# Altium schematic sheet switches_connectors.SchDoc
size A4; SheetNumber: 2; SheetTotal: 6
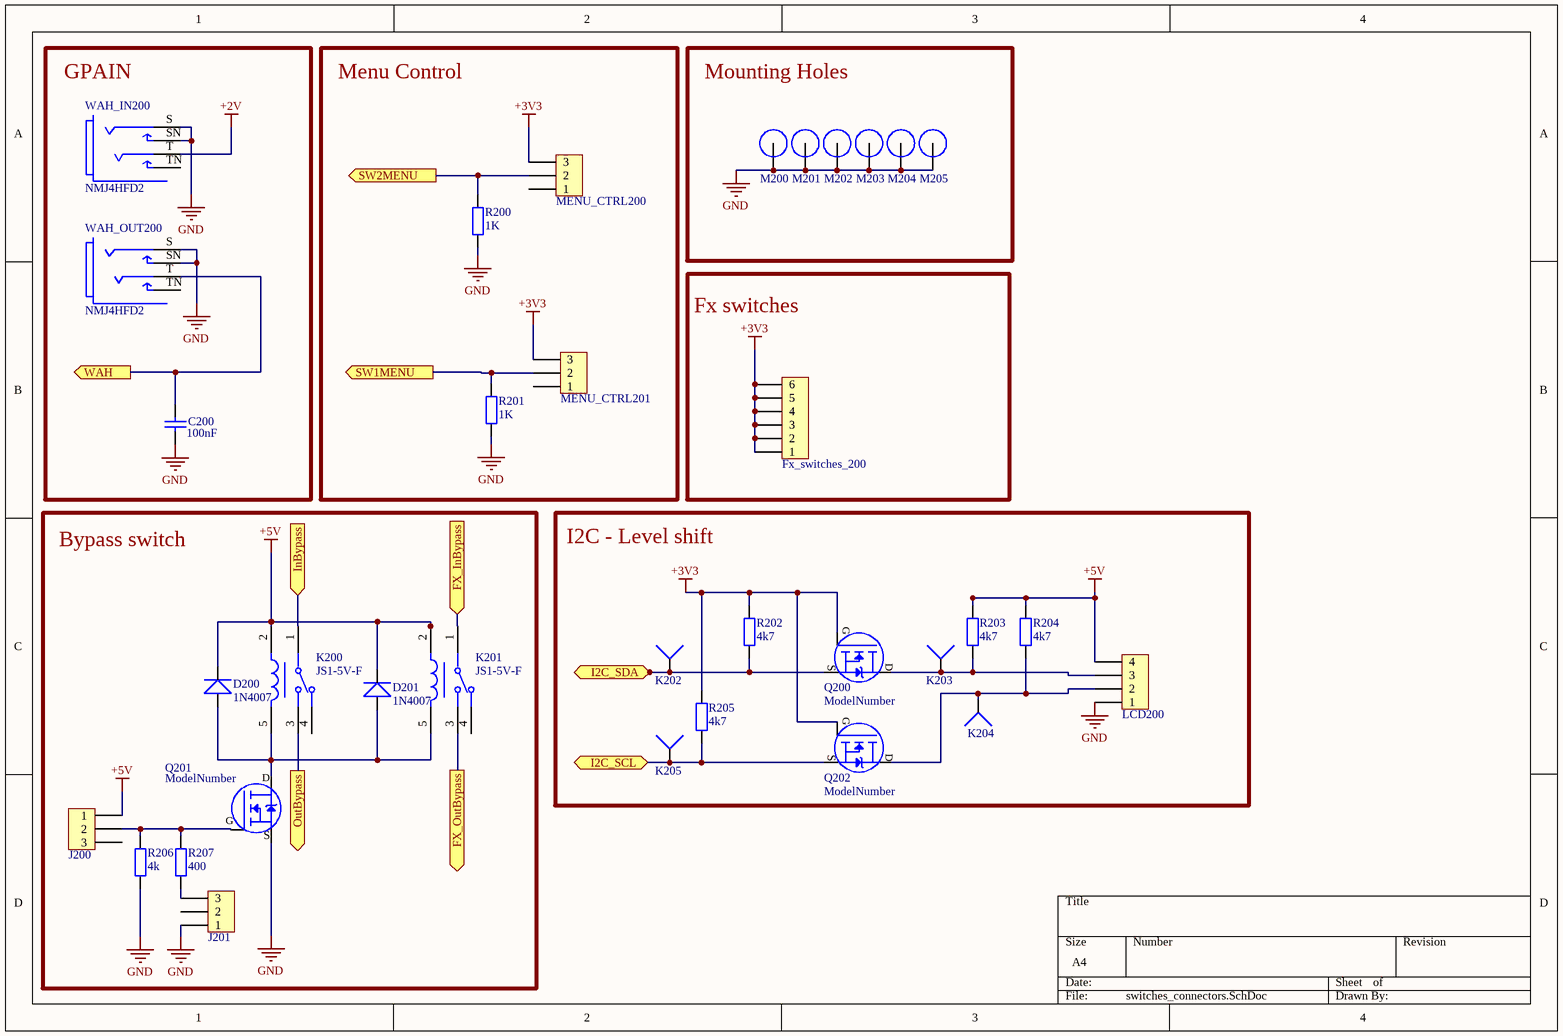
[diagram p0: switches_connectors.SchDoc]

## Parts
C200  value 100nF  [Cap-1]  (hidden comment: Cap)
D200  1N4007  [1N4007]
D201  1N4007  [1N4007]
Fx_switches_200  Header 1x6  [Header 1x6]  (value not drawn)
J200  Header 1x3  [Header 1x3]  (value not drawn)
J201  Header 1x3  [Header 1x3]  (value not drawn)
K200  JS1-5V-F  [FP-JS1-5V-F-MFG]
K201  JS1-5V-F  [FP-JS1-5V-F-MFG]
K202  Wire  [Wire 1.5mm]  (value not drawn)
K203  Wire  [Wire 1.5mm]  (value not drawn)
K204  Wire  [Wire 1.5mm]  (value not drawn)
K205  Wire  [Wire 1.5mm]  (value not drawn)
LCD200  Header 1x4  [Header 1x4]  (value not drawn)
M200  Screw Hole  [M3 Hole]  (value not drawn)  (no BOM)
M201  Screw Hole  [M3 Hole]  (value not drawn)  (no BOM)
M202  Screw Hole  [M3 Hole]  (value not drawn)  (no BOM)
M203  Screw Hole  [M3 Hole]  (value not drawn)  (no BOM)
M204  Screw Hole  [M3 Hole]  (value not drawn)  (no BOM)
M205  Screw Hole  [M3 Hole]  (value not drawn)  (no BOM)
MENU_CTRL200  Header 1x3  [Header 1x3]  (value not drawn)
MENU_CTRL201  Header 1x3  [Header 1x3]  (value not drawn)
Q200  Model: ModelNumber  [TO-92_straight]  (hidden comment: ModelNum)
Q201  Model: ModelNumber  [TO-220]  (hidden comment: ModelNum)
Q202  Model: ModelNumber  [TO-92_straight]  (hidden comment: ModelNum)
R200  value 1K  [RES THT 9mm]  (hidden comment: Resistor)
R201  value 1K  [RES THT 9mm]  (hidden comment: Resistor)
R202  value 4k7  [RES THT 9mm]  (hidden comment: Resistor)
R203  value 4k7  [RES THT 9mm]  (hidden comment: Resistor)
R204  value 4k7  [RES THT 9mm]  (hidden comment: Resistor)
R205  value 4k7  [RES THT 9mm]  (hidden comment: Resistor)
R206  value 4k  [RES THT 9mm]  (hidden comment: Resistor)
R207  value 400  [RES THT 9mm]  (hidden comment: Resistor)
WAH_IN200  NMJ4HFD2  [FP-NMJ4HFD2-MFG]
WAH_OUT200  NMJ4HFD2  [FP-NMJ4HFD2-MFG]

## Blocks framed on the sheet
GPAIN: C200 WAH_IN200 WAH_OUT200
Menu Control: MENU_CTRL200 MENU_CTRL201 R200 R201
Mounting Holes: M200-M205
Fx switches: Fx_switches_200
Bypass switch: D200 D201 J200 J201 K200 K201 Q201 R206 R207
I2C - Level shift: K202-K205 LCD200 Q200 Q202 R202-R205

## Ports
FX_InBypass (in), FX_OutBypass (out), I2C_SCL (bidir), I2C_SDA (bidir), InBypass (in), OutBypass (out), SW1MENU (out), SW2MENU (out), WAH (out)

## Nets
+2V: WAH_IN200.T
+3V3: Fx_switches_200.1 Fx_switches_200.2 Fx_switches_200.3 Fx_switches_200.4 Fx_switches_200.5 Fx_switches_200.6 MENU_CTRL200.3 MENU_CTRL201.3 Q200.1(G) Q202.1(G) R202.2 R205.2
+5V: D200.2 D201.2 J200.1 K200.2(1_COIL) K201.2(1_COIL) LCD200.4 R203.2 R204.2
GND: C200.1 J201.1 LCD200.1 M200.1 M201.1 M202.1 M203.1 M204.1 M205.1 Q201.3(S) R200.1 R201.1 R206.1 WAH_IN200.S WAH_IN200.SN WAH_OUT200.S WAH_OUT200.SN
FX_InBypass: K201.1(COM) ; port FX_InBypass
FX_OutBypass: K201.3(N.O.) ; port FX_OutBypass
I2C_SCL: K205.1 Q202.3(S) R205.1 ; port I2C_SCL
I2C_SDA: K202.1 Q200.3(S) R202.1 ; port I2C_SDA
InBypass: K200.1(COM) ; port InBypass
OutBypass: K200.3(N.O.) ; port OutBypass
SW1MENU: MENU_CTRL201.2 R201.2 ; port SW1MENU
SW2MENU: MENU_CTRL200.2 R200.2 ; port SW2MENU
WAH: C200.2(g) WAH_OUT200.T ; port WAH
NetD200_1: D200.1 D201.1 K200.5(2_COIL) K201.5(2_COIL) Q201.2(D)
NetJ200_2: J200.2 Q201.1(G) R206.2 R207.2
NetJ201_3: J201.3 R207.1
NetK203_1: K203.1 LCD200.3 Q200.2(D) R203.1
NetK204_1: K204.1 LCD200.2 Q202.2(D) R204.1

Not connected (* = marked no-connect by the designer): J200 3; J201 2; K200 4(N.C.); K201 4(N.C.); MENU_CTRL200 1; MENU_CTRL201 1; WAH_IN200 TN; WAH_OUT200 TN

## Library data of the parts
C200 = Capacitor 1 space
K200 K201 = CMP-05606-000016-1: RELAY GEN PURPOSE SPDT 10A 5V; Manufacturer: Panasonic; Coil Type: Non-Latching; Number Of Contacts: 1; Standoff Height: 0.3mm; Switching Power: 150W; Coil Power: 360mW; Coil Current: 72mA; Coil Resistance: 69.4Ω; Lead Free: Yes; Device Class L3: Power Relays; Device Class L1: Electromechanical; Ambient Temperature Range High: +70°C; Temperature: -40°C to +70°C; Temperature Range High: +70°C; Temperature Range Low: -40°C; Manufacturer Part Number: JS1-5V-F; Coil Voltage: 5V; Switching Current: 10A; Digikey Description: RELAY GEN PURPOSE SPDT 10A 5V; Device Class L2: Relays; Ambient Temperature Range Low: -40°C; Throw Configuration: SPDT; Category: Relay; ComponentLink2URL: https://www3.panasonic.biz/ac/e_download/control/relay/power/catalog/mech_eng_js.pdf?via=ok; Package: JS1-5V-F; Octopart: https://octopart.com/js1-5v-f-panasonic-39428621; Mouser Description: JS Series 10 A SPDT 5 V Through Hole Sealed Miniature Non-Polarized Power Relay; Height: 16.8mm; ComponentLink2Description: Datasheet; RoHS: TRUE; Automotive: No
Q200 Q202 = MOSFET N-Channel: pin to pad: 2>3 3>2
Q201 = MOSFET N-Channel
WAH_IN200 WAH_OUT200 = CMP-78736-000001-1: Conn 1/4" Mono Jack F 3 POS Solder RA Thru-Hole 3 Terminal 1 Port; Manufacturer: Neutrik; Number Of Contacts: 2; Current Rating: 0.5A; Voltage Rating: 50V; Conn Orientation: Horizontal; Is Female: yes; Temperature: -25°C to +70°C; ComponentLink2Description: Datasheet; ComponentLink2URL: https://www.neutrik.com/en/product/nmj4hfd2.pdf; Contact Material: Silver; Height: 15.89mm; Package: 0; Mouser Description: Phone Audio Connector, Socket, 2, PCB Mount, Metal Body, Silver Plated Contacts; Manufacturer Part Number: NMJ4HFD2; Automotive: No; RoHS: TRUE; Lead Free: Yes; Device Class L2: Audio / Video Connectors; Device Class L3: unset; Temperature Range Low: -25°C; Category: Conn; Footprint Url: https://www.neutrik.com/media/8576/download/st-nmj4hfd2.pdf?v=1; Temperature Range High: +70°C; Device Class L1: Connectors; Octopart: https://octopart.com/nmj4hfd2-neutrik-758952